# Altium schematic sheet 电源分配_01.SchDoc
size A3; PageSetup: Record=PageOptions|CenterHorizontal=True|CenterVertical=True|PrintScale=1.00|XCorrection=1.00|YCorrection=1.00|PrintKind=2|BorderSize=5000000|LeftOffset=0|BottomOffset=0|Orientation=2|PaperLength=1000|PaperWidth=1000|Scale=100|PaperSource=7|PrintQuality=-4|MediaType=1|DitherType=10|PaperKind=A3|PrintScaleMode=1
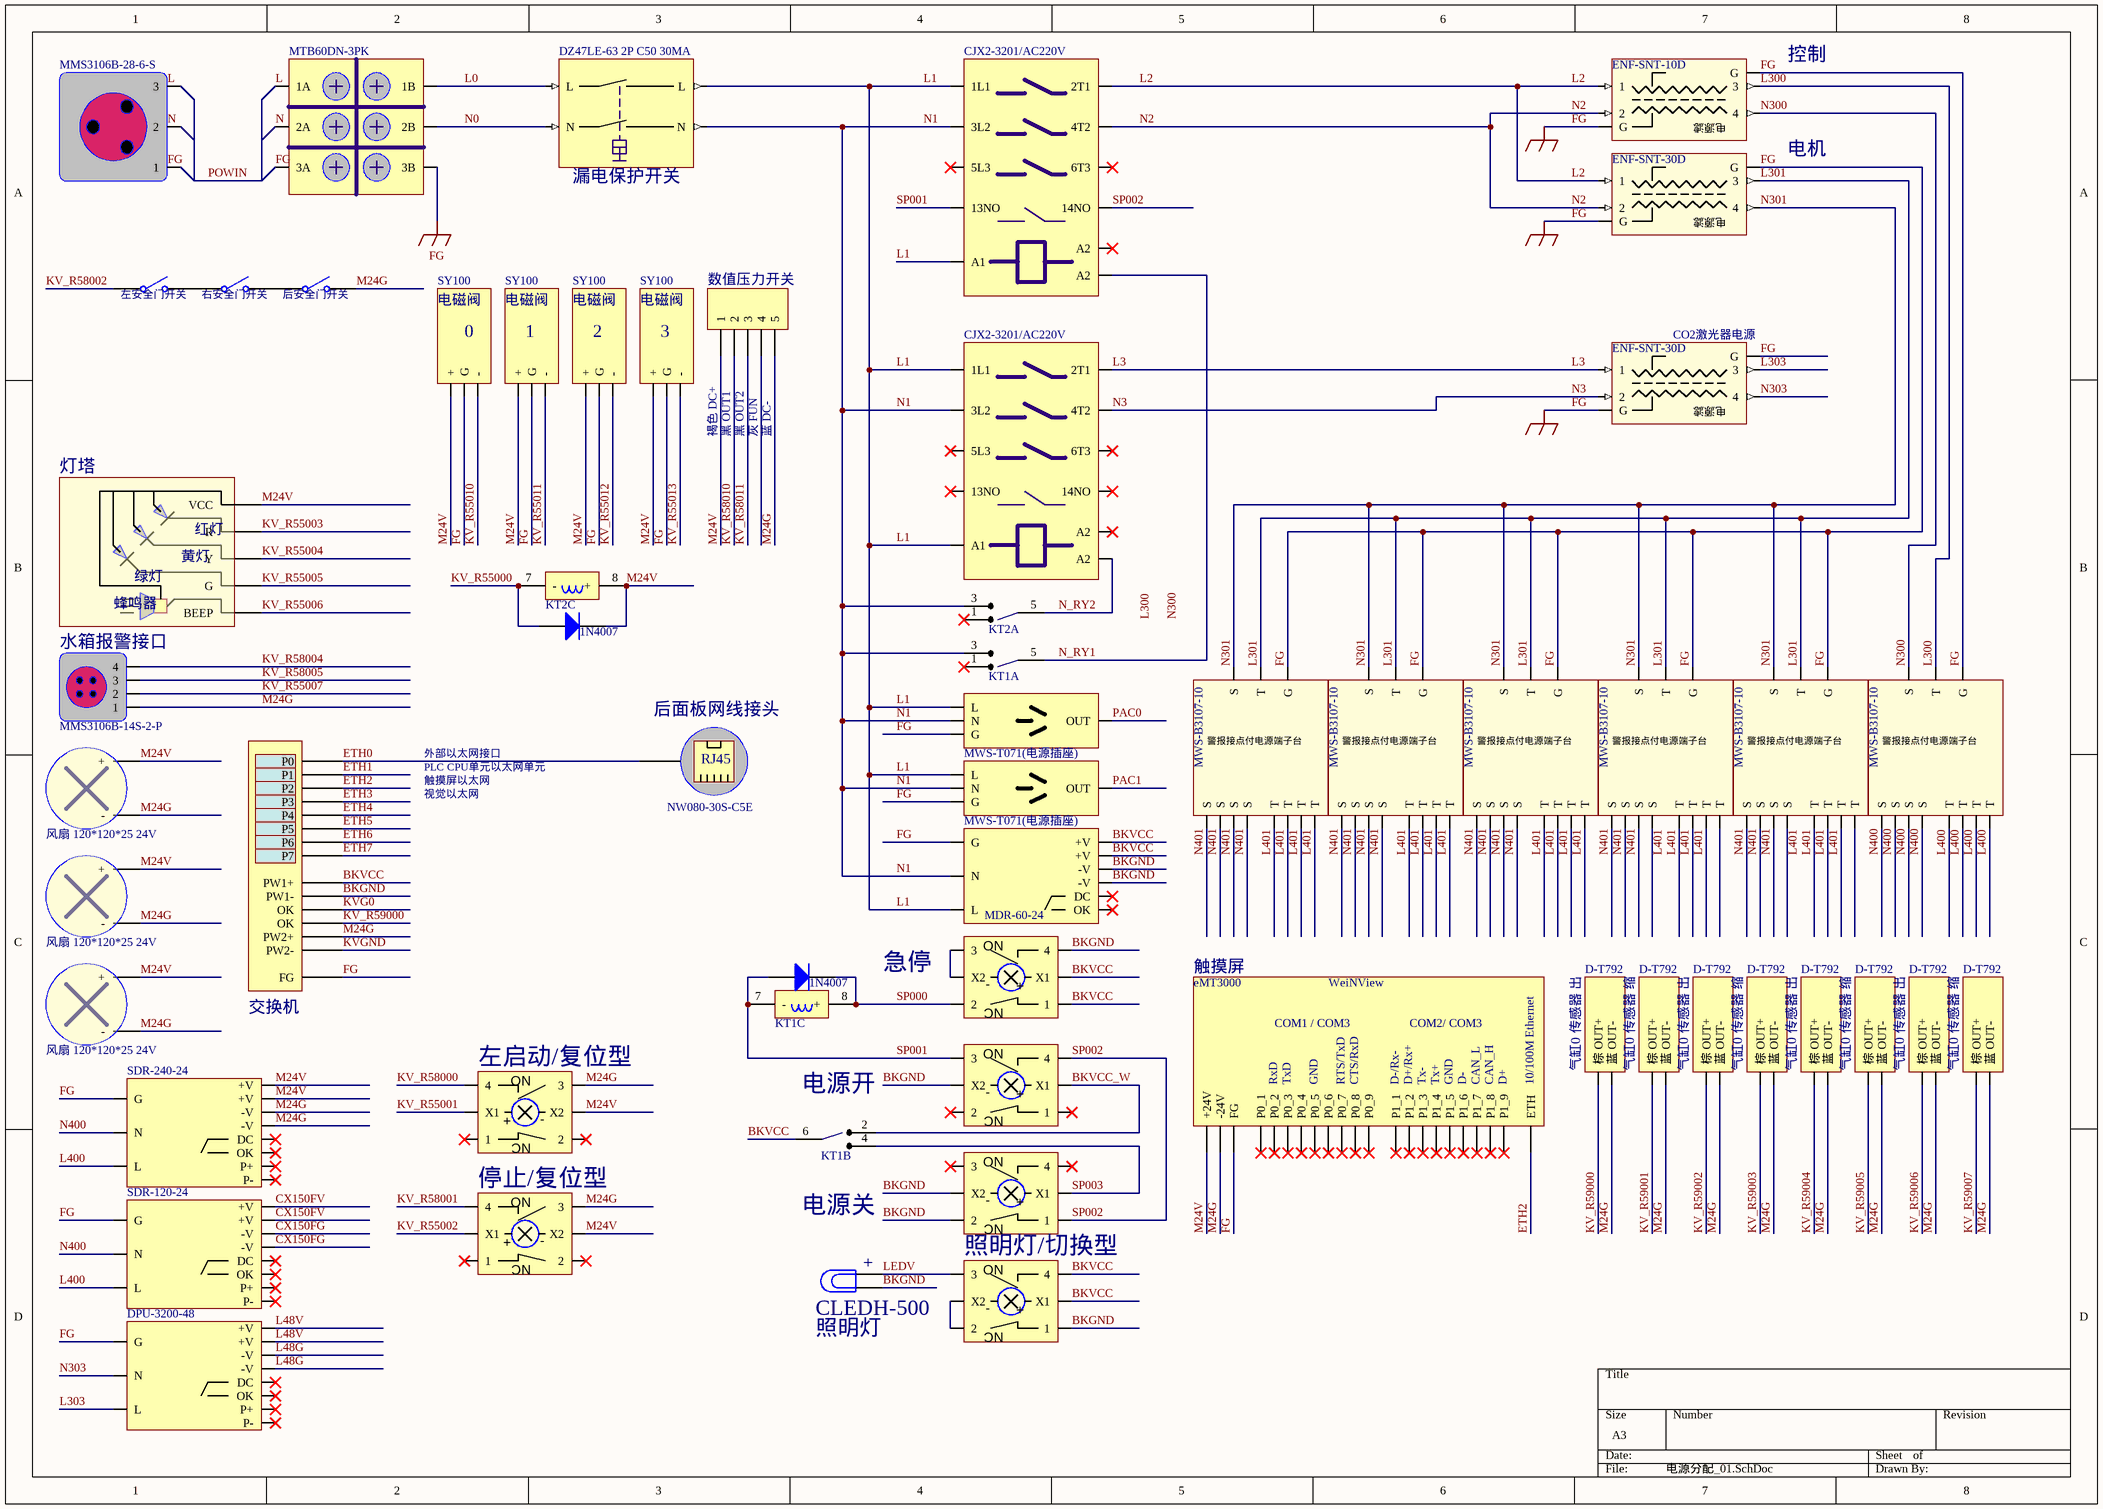
[diagram p0: 电源分配_01.SchDoc]

## Parts
(Parts that share a designator on the sheet are numbered #1, #2 ... from top to bottom, then left to right.)
*#1  DZ47LE-63 2P C50 30MA
*#2  ENF-SNT-10D
*#3  MMS3106B-28-6-S
*#4  MTB60DN-3PK
*#5  CJX2-3201/AC220V
*#6  ENF-SNT-30D
*#7  SY100
*#8  SY100
*#9  SY100
*#10  SY100
*#11  ENF-SNT-30D
*#12  CJX2-3201/AC220V
*#13  灯塔  (value not drawn)
*#14  MMS3106B-14S-2-P
*#15  MWS-T071(电源插座)
*#16  MWS-B3107-10
*#17  MWS-B3107-10
*#18  MWS-B3107-10
*#19  MWS-B3107-10
*#20  MWS-B3107-10
*#21  MWS-B3107-10
*#22  NW080-30S-C5E
*#23  风扇 120*120*25 24V
*#24  MWS-T071(电源插座)
*#25  SWITCH  (value not drawn)
*#26  MDR-60-24
*#27  风扇 120*120*25 24V
*#28  YMP22C-LMC2  (value not drawn)
*#29  风扇 120*120*25 24V
*#30  D-T792
*#31  D-T792
*#32  D-T792
*#33  D-T792
*#34  D-T792
*#35  D-T792
*#36  D-T792
*#37  D-T792
*#38  eMT3000
*#39  YMP22C-LMC2  (value not drawn)
*#40  YMP22C-LMC2  (value not drawn)
*#41  SDR-240-24
*#42  YMP22C-LMC2  (value not drawn)
*#43  YMP22C-LMC2  (value not drawn)
*#44  SDR-120-24
*#45  YMP22C-LMC2  (value not drawn)
*#46  DPU-3200-48
D?#1  1N4007  [DO-41]
D?#2  1N4007  [DO-41]
DS?  Lamp  [PIN2]  (value not drawn)
KT1  LY2N-J  (value not drawn)  (parts A,B,C of 3)
KT2  LY2N-J  (value not drawn)  (parts A,C of 3)
P?  Header 5  [HDR1X5]  (value not drawn)
S?#1  SW-SPST  [SPST-2]  (value not drawn)
S?#2  SW-SPST  [SPST-2]  (value not drawn)
S?#3  SW-SPST  [SPST-2]  (value not drawn)

## Nets
FG: *#2.1(G) *#4.2(3A) *#6.1(G) *#7.1(G) *#8.1(G) *#9.1(G) *#10.1(G) *#11.1(G) *#15.0(G) *#16.2(G) *#17.2(G) *#18.2(G) *#19.2(G) *#20.2(G) *#21.2(G) *#24.0(G) *#25.0(FG) *#26.6(G) *#38.174(FG) *#41.6(G) *#44.6(G) *#46.6(G)
BKGND: *#25.0(PW1-) *#26.2(-V) *#26.3(-V) *#28.3(4) *#39.5(X2) *#42.1(2) *#42.5(X2) *#45.0(1) DS?.1
BKVCC: *#25.0(PW1+) *#26.0(+V) *#26.1(+V) *#28.0(1) *#28.4(X1) *#45.3(4) *#45.4(X1) KT1.6
BKVCC_W: *#39.4(X1) KT1.2
CX150FG: *#44.2(-V) *#44.3(-V)
CX150FV: *#44.0(+V) *#44.1(+V)
ETH0: *#22.0 *#25.3(P0)
ETH1: *#25.4(P1)
ETH2: *#25.5(P2) *#38.193(ETH)
ETH3: *#25.6(P3)
ETH4: *#25.3(P4)
ETH5: *#25.4(P5)
ETH6: *#25.5(P6)
ETH7: *#25.6(P7)
KV_R55000: D?#1.1(A) KT2.7(-)
KV_R55001: *#40.4(X1)
KV_R55002: *#43.4(X1)
KV_R55003: *#13.0(R)
KV_R55004: *#13.0(Y)
KV_R55005: *#13.0(G)
KV_R55006: *#13.0(BEEP)
KV_R55007: *#14.1(2)
KV_R55010: *#7.2(-)
KV_R55011: *#8.2(-)
KV_R55012: *#9.2(-)
KV_R55013: *#10.2(-)
KV_R58000: *#40.3(4)
KV_R58001: *#43.3(4)
KV_R58002: S?#1.1(COMMON)
KV_R58004: *#14.3(4)
KV_R58005: *#14.2(3)
KV_R58010: P?.2
KV_R58011: P?.3
KV_R59000: *#25.2(OK) *#30.1(棕_OUT+)
KV_R59001: *#31.1(棕_OUT+)
KV_R59002: *#32.1(棕_OUT+)
KV_R59003: *#33.1(棕_OUT+)
KV_R59004: *#34.1(棕_OUT+)
KV_R59005: *#35.1(棕_OUT+)
KV_R59006: *#36.1(棕_OUT+)
KV_R59007: *#37.1(棕_OUT+)
KVG0: *#25.1(OK)
KVGND: *#25.0(PW2-)
L: *#4.0(1A)
L0: *#1.1(L) *#4.0(1B)
L1: *#1.3(L) *#5.1L1 *#12.1L1 *#15.2(L) *#24.2(L) *#26.8(L)
L2: *#2.1 *#5.3(2T1) *#6.1
L3: *#11.1 *#12.3(13NO)
L48G: *#46.2(-V) *#46.3(-V)
L48V: *#46.0(+V) *#46.1(+V)
L300: *#2.3 *#21.1(T)
L301: *#6.3 *#16.1(T) *#17.1(T) *#18.1(T) *#19.1(T) *#20.1(T)
L303: *#11.3 *#46.8(L)
L400: *#21.1(T) *#41.8(L) *#44.8(L)
L401: *#16.1(T) *#17.1(T) *#18.1(T) *#19.1(T) *#20.1(T)
LEDV: *#45.2(3) DS?.2
M24G: *#14.0(1) *#23.19(-) *#25.0(PW2+) *#27.19(-) *#29.19(-) *#30.2(蓝_OUT-) *#31.2(蓝_OUT-) *#32.2(蓝_OUT-) *#33.2(蓝_OUT-) *#34.2(蓝_OUT-) *#35.2(蓝_OUT-) *#36.2(蓝_OUT-) *#37.2(蓝_OUT-) *#38.173(-24V) *#40.2(3) *#41.2(-V) *#41.3(-V) *#43.2(3) P?.5 S?#3.2(NO)
M24V: *#7.0(+) *#8.0(+) *#9.0(+) *#10.0(+) *#13.1(VCC) *#23.20(+) *#27.20(+) *#29.20(+) *#38.172(+24V) *#40.5(X2) *#41.0(+V) *#41.1(+V) *#43.5(X2) D?#1.2(K) KT2.8(+) P?.1
N: *#4.1(2A)
N0: *#1.0(N) *#4.1(2B)
N1: *#1.2(N) *#5.3L2 *#12.3L2 *#15.1(N) *#24.1(N) *#26.7(N) KT1.3 KT2.3
N2: *#2.2 *#5.5L3 *#6.2
N3: *#11.2 *#12.5L3
N300: *#2.4 *#21.0(S)
N301: *#6.4 *#16.0(S) *#17.0(S) *#18.0(S) *#19.0(S) *#20.0(S)
N303: *#11.4 *#46.7(N)
N400: *#21.0(S) *#41.7(N) *#44.7(N)
N401: *#16.0(S) *#17.0(S) *#18.0(S) *#19.0(S) *#20.0(S)
N_RY1: *#5.1L1(A2) KT1.5
N_RY2: *#12.1L1(A2) KT2.5
PAC0: *#15.1(OUT)
PAC1: *#24.1(OUT)
SP000: *#28.1(2) D?#2.2(K) KT1.8(+)
SP001: *#5.3(13NO) *#39.2(3) D?#2.1(A) KT1.7(-)
SP002: *#5.1L1(14NO) *#39.3(4) *#42.0(1)
SP003: *#42.4(X1) KT1.4
Net*#28_2: *#28.2(3) *#28.5(X2)
Net*#45_1: *#45.1(2) *#45.5(X2)
NetS?#1_2: S?#1.2(NO) S?#2.1(COMMON)
NetS?#2_2: S?#2.2(NO) S?#3.1(COMMON)

Not connected (* = marked no-connect by the designer): *#3 0(1) 1(2) 2(3); *#26 4(DC)* 5(OK)*; *#38 175(P0_1)* 176(P0_2)* 177(P0_3)* 178(P0_4)* 179(P0_5)* 180(P0_6)* 181(P0_7)* 182(P0_8)* 183(P0_9)* 184(P1_1)* 185(P1_2)* 186(P1_3)* 187(P1_4)* 188(P1_5)* 189(P1_6)* 190(P1_7)* 191(P1_8)* 192(P1_9)*; *#39 0(1)* 1(2)*; *#40 0(1)* 1(2)*; *#41 4(DC)* 5(OK)*; *#42 2(3)* 3(4)*; *#43 0(1)* 1(2)*; *#44 4(DC)* 5(OK)*; *#46 4(DC)* 5(OK)*; KT1 1*; KT2 1*; P? 4

## Buses and harness runs
bus POWIN

## Notes on the sheet
- (near *#2) 控制
- (near *#1) 漏电保护开关
- (near *#6) 电机
- (near S?#1) 左安全门开关
- (near S?#2) 右安全门开关
- (near S?#3) 后安全门开关
- 电磁阀
- (near P?) 数值压力开关
- (near *#7) 0
- (near *#8) 1
- (near *#9) 2
- 3
- (near *#11) CO2激光器电源
- (near *#10) 褐色 DC+
- (near *#10) 黑 OUT1
- 黑 OUT2
- 灰 FUN
- 蓝 DC-
- 灯塔
- (near *#14) 水箱报警接口
- (near *#22) 后面板网线接头
- 外部以太网接口
- PLC CPU单元以太网单元
- 触摸屏以太网
- 视觉以太网
- 急停
- 触摸屏
- (near *#25) 交换机
- (near *#40) 左启动/复位型
- (near KT1) 电源开
- (near *#30) 气缸0 传感器 出
- (near *#30) 气缸0 传感器 缩
- (near *#31) 气缸0 传感器 出
- (near *#32) 气缸0 传感器 缩
- (near *#33) 气缸0 传感器 出
- (near *#34) 气缸0 传感器 缩
- (near *#35) 气缸0 传感器 出
- (near *#36) 气缸0 传感器 缩
- (near *#43) 停止/复位型
- 电源关
- (near *#42) 照明灯/切换型
- (near DS?) CLEDH-500
- (near DS?) +
- (near DS?) 照明灯
- Labels drawn without touching a wire or pin: FG, L, L300, L401, N, N300
- (in symbol eMT3000) WeiNView; COM1 / COM3; COM2/ COM3; RxD; TxD; GND; RTS/TxD; CTS/RxD; D-/Rx-; D+/Rx+; Tx-; Tx+; D-; CAN_L; CAN_H; D+; 10/100M Ethernet
- (in symbol ENF-SN) 电源滤
- (in symbol MWS-B3107-10) 警报接点付电源端子台
- (in symbol NW080-30S-C5E) RJ45
- (in symbol YMP22C) NO; -; +; NC
- (in symbol 灯塔) 红灯; 黄灯; 绿灯; 蜂鸣器

## Library data of the parts
*#1 = 空气开关(单相)
*#2 *#6 *#11 = ENF-SN
*#3 = MMS3106B-2
*#4 = MTB60D
*#5 *#12 = CJX2-3201/A
*#14 = EMSH-RST-C9-CA-5
*#23 *#27 *#29 = FAN
*#26 = MDR-60
*#28 *#39 *#40 *#42 *#43 *#45 = YMP22C
*#41 *#44 *#46 = SDR-480P
D?#1 D?#2 = Diode 1N4007: 1 Amp General Purpose Rectifier; Published: 8-Jun-2000; LatestRevisionDate: 17-Jul-2002; LatestRevisionNote: Re-released for DXP Platform.; DatasheetVersion: 1998; PackageVersion: Aug-1999; PackageReference: DO-41; Publisher: Altium Limited; PackageDescription: Diode, Axial; Body 5.2 x 2.7 mm (LxDia. max), Lead Dia. 0.86 mm (max); Code_JEDEC: DO-204-AL; ComponentLink1Description: Manufacturer Link; ComponentLink1URL: http://www.fairchildsemi.com/; ComponentLink2Description: Datasheet; ComponentLink2URL: http://www.fairchildsemi.com/ds/1N%2F1N4001.pdf
DS? = Lamp: Incandescent Bulb; Published: 24-Mar-1999; LatestRevisionDate: 17-Jul-2002; LatestRevisionNote: Re-released for DXP Platform.; PackageReference: PIN2; Publisher: Altium Limited
KT1 KT2 = L
P? = Header 5: Header, 5-Pin; LatestRevisionDate: 17-Jul-2002; LatestRevisionNote: Re-released for DXP Platform.; Publisher: Altium Limited
S?#1-S?#3 = SW-SPST: Single-Pole, Single-Throw Switch; Published: 24-Mar-1999; LatestRevisionDate: 17-Jul-2002; LatestRevisionNote: Re-released for DXP Platform.; PackageReference: SPST-2; Publisher: Altium Limited